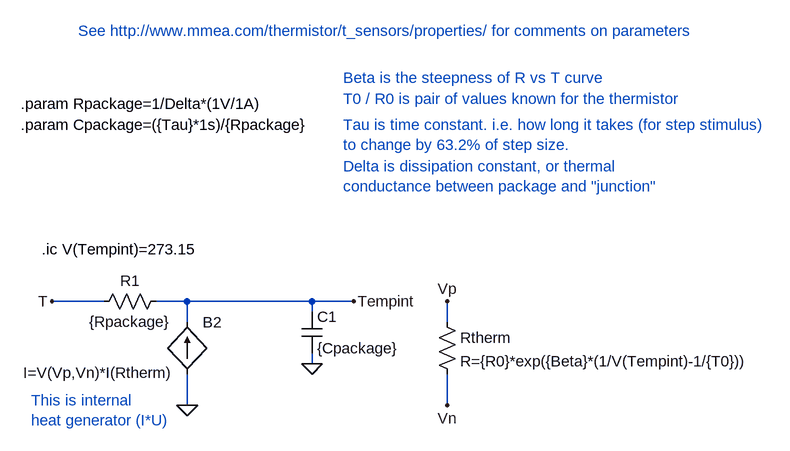
[diagram p0: schematic Thermistor.asc]
Thermistor.asc, the LTspice schematic file:
Version 4
SHEET 1 880 680
WIRE -512 256 -592 256
WIRE -384 256 -432 256
WIRE -384 288 -384 256
WIRE -384 416 -384 368
WIRE -192 256 -384 256
WIRE -192 272 -192 256
WIRE -192 352 -192 336
WIRE -128 256 -192 256
WIRE 16 288 16 256
WIRE 16 416 16 368
FLAG 16 256 Vp
FLAG 16 416 Vn
FLAG -128 256 Tempint
FLAG -384 416 0
FLAG -592 256 T
FLAG -192 352 0
SYMBOL res -416 240 R90
WINDOW 0 0 56 VBottom 0
WINDOW 3 32 56 VTop 0
SYMATTR InstName R1
SYMATTR Value {Rpackage}
SYMBOL bi2 -384 288 R0
WINDOW 3 -252 78 Left 0
SYMATTR Value I=V(Vp,Vn)*I(Rtherm)
SYMATTR InstName B2
SYMBOL cap -208 272 R0
SYMATTR InstName C1
SYMATTR Value {Cpackage}
SYMATTR SpiceLine ic=273.15
SYMBOL res 0 272 R0
SYMATTR InstName Rtherm
SYMATTR Value R={R0}*exp({Beta}*(1/V(Tempint)-1/{T0}))
TEXT -144 -88 Left 0 ;Beta is the steepness of R vs T curve
TEXT -144 -56 Left 0 ;T0 / R0 is pair of values known for the thermistor
TEXT -640 -16 Left 0 !.param Cpackage=({Tau}*1s)/{Rpackage}
TEXT -640 -48 Left 0 !.param Rpackage=1/Delta*(1V/1A)
TEXT -144 -16 Left 0 ;Tau is time constant. i.e. how long it takes (for step stimulus) \nto change by 63.2% of step size.
TEXT -144 48 Left 0 ;Delta is dissipation constant, or thermal\nconductance between package and "junction"
TEXT -552 -160 Left 0 ;See http://www.mmea.com/thermistor/t_sensors/properties/ for comments on parameters
TEXT -608 176 Left 0 !.ic V(Tempint)=273.15
TEXT -624 408 Left 0 ;This is internal\nheat generator (I*U)

The netlist it stands for:
* Thermistor.asc
R1 Tempint T {Rpackage}
B2 0 Tempint I=V(Vp,Vn)*I(Rtherm)
C1 Tempint 0 {Cpackage} ic=273.15
Rtherm Vp Vn R={R0}*exp({Beta}*(1/V(Tempint)-1/{T0}))
* Beta is the steepness of R vs T curve
* T0 / R0 is pair of values known for the thermistor
.param Cpackage=({Tau}*1s)/{Rpackage}
.param Rpackage=1/Delta*(1V/1A)
* Tau is time constant. i.e. how long it takes (for step stimulus)
* to change by 63.2% of step size.
* Delta is dissipation constant, or thermal
* conductance between package and "junction"
* See http://www.mmea.com/thermistor/t_sensors/properties/ for comments on parameters
.ic V(Tempint)=273.15
* This is internal
* heat generator (I*U)
.backanno
.end